# EAGLE design mainboardv0.2 (EAGLE 6.5.0)
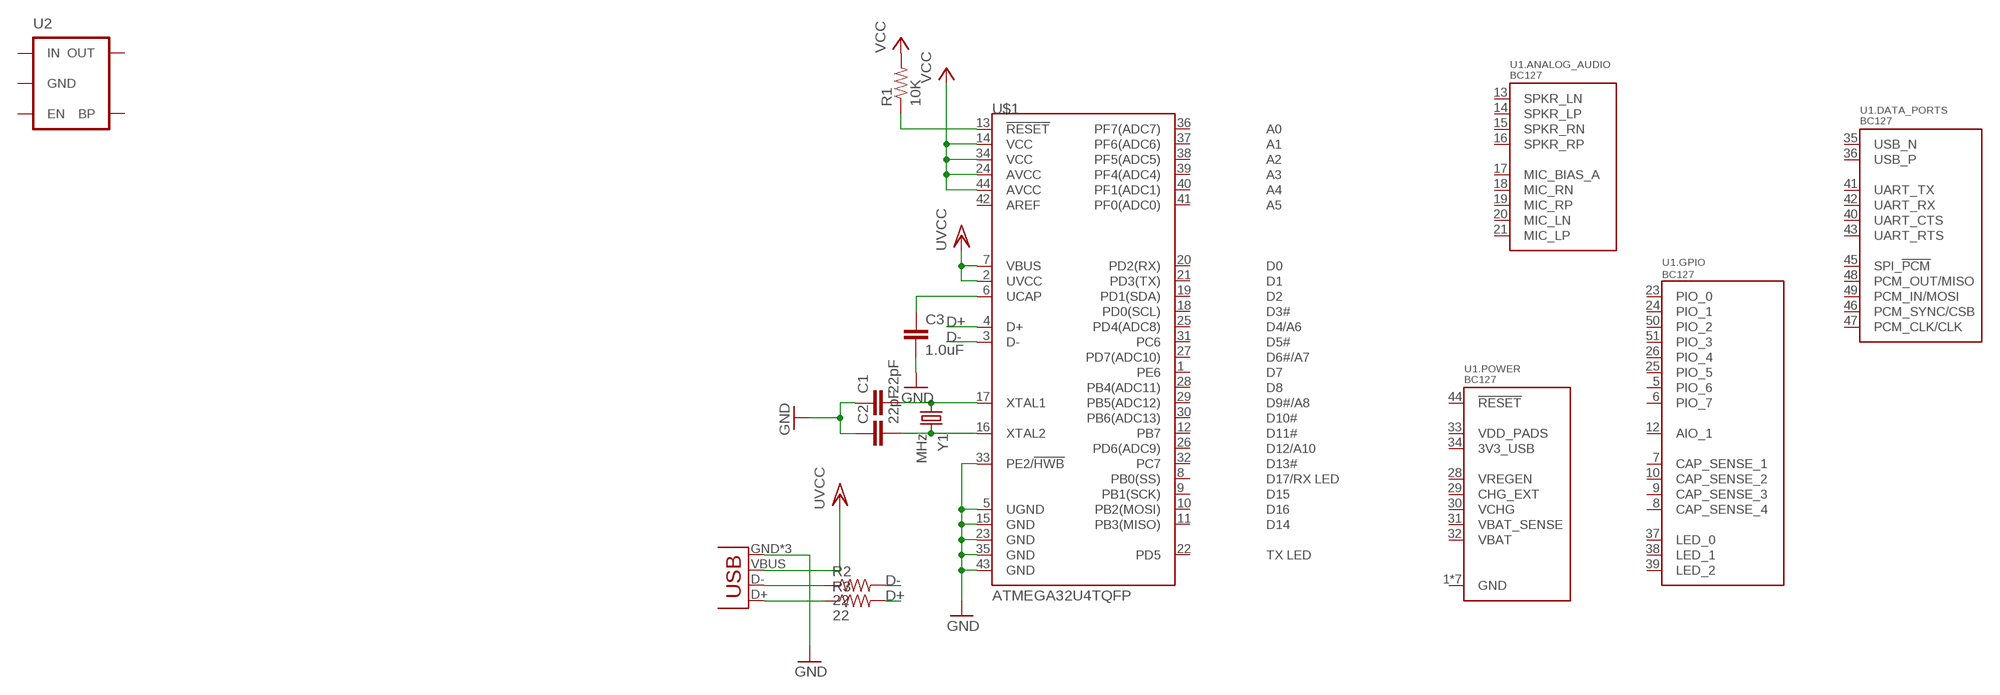
[diagram p0: schematic, sheet 1]

## Parts
C1  22pF  22PF-50V-5%(0603)  [0603-CAP]
C2  22pF  22PF-50V-5%(0603)  [0603-CAP]
C3  1.0uF  1.0UF-16V-10%(0603)  [0603-CAP]
JP1  USB-MICROB  [USB-MICROB]
R1  10K  10KOHM1/10W1%(0603)0603  [0603-RES]
R2  22  22OHM1/10W1%(0603)  [0603-RES]
R3  22  22OHM1/10W1%(0603)  [0603-RES]
U1  BC127  [BC127]
U2  MIC52053.3V  [SOT23-5]
U$1  ATMEGA32U4TQFP  [SPARKFUN-DIGITALIC_TQFP44]
Y1  MHz  CRYSTAL5X3  [CRYSTAL-SMD-5X3]

## Nets
D+: R3.2 U$1.4(D+)
D-: R2.2 U$1.3(D-)
GND: C1.1 C2.1 C3.2 JP1.GND JP1.MT1(GND) JP1.MT2(GND) U$1.5(UGND) U$1.15(GND) U$1.23(GND) U$1.33(PE2/!HWB) U$1.35(GND) U$1.43(GND)
N$1: R1.1 U$1.13(!RESET)
N$2: C1.2 U$1.17(XTAL1) Y1.1
N$3: C2.2 U$1.16(XTAL2) Y1.3
N$4: C3.1 U$1.6(UCAP)
N$7: JP1.D- R2.1
N$8: JP1.D+ R3.1
VCC: R1.2 U$1.14(VCC) U$1.24(AVCC) U$1.34(VCC) U$1.44(AVCC)
VCC/2: JP1.VBUS U$1.2(UVCC) U$1.7(VBUS) ; supply symbol labelled UVCC
Unconnected: U1.1(.POWER:GND) U1.2(.POWER:GND) U1.3(.POWER:GND) U1.4(.POWER:GND) U1.5(.GPIO:PIO_6) U1.6(.GPIO:PIO_7) U1.7(.GPIO:CAP_SENSE_1) U1.8(.GPIO:CAP_SENSE_4) U1.9(.GPIO:CAP_SENSE_3) U1.10(.GPIO:CAP_SENSE_2) U1.11(.POWER:GND) U1.12(.GPIO:AIO_1) U1.13(.ANALOG_AUDIO:SPKR_LN) U1.14(.ANALOG_AUDIO:SPKR_LP) U1.15(.ANALOG_AUDIO:SPKR_RN) U1.16(.ANALOG_AUDIO:SPKR_RP) U1.17(.ANALOG_AUDIO:MIC_BIAS_A) U1.18(.ANALOG_AUDIO:MIC_RN) U1.19(.ANALOG_AUDIO:MIC_RP) U1.20(.ANALOG_AUDIO:MIC_LN) U1.21(.ANALOG_AUDIO:MIC_LP) U1.22(.POWER:GND) U1.23(.GPIO:PIO_0) U1.24(.GPIO:PIO_1) U1.25(.GPIO:PIO_5) U1.26(.GPIO:PIO_4) U1.27(.POWER:GND) U1.28(.POWER:VREGEN) U1.29(.POWER:CHG_EXT) U1.30(.POWER:VCHG) U1.31(.POWER:VBAT_SENSE) U1.32(.POWER:VBAT) U1.33(.POWER:VDD_PADS) U1.34(.POWER:3V3_USB) U1.35(.DATA_PORTS:USB_N) U1.36(.DATA_PORTS:USB_P) U1.37(.GPIO:LED_0) U1.38(.GPIO:LED_1) U1.39(.GPIO:LED_2) U1.40(.DATA_PORTS:UART_CTS) U1.41(.DATA_PORTS:UART_TX) U1.42(.DATA_PORTS:UART_RX) U1.43(.DATA_PORTS:UART_RTS) U1.44(.POWER:!RESET) U1.45(.DATA_PORTS:SPI_!PCM) U1.46(.DATA_PORTS:PCM_SYNC/CSB) U1.47(.DATA_PORTS:PCM_CLK/CLK) U1.48(.DATA_PORTS:PCM_OUT/MISO) U1.49(.DATA_PORTS:PCM_IN/MOSI) U1.50(.GPIO:PIO_2) U1.51(.GPIO:PIO_3) U2.1(IN) U2.2(GND) U2.3(EN) U2.4(BP) U2.5(OUT) U$1.1(PE6) U$1.8(PB0(SS)) U$1.9(PB1(SCK)) U$1.10(PB2(MOSI)) U$1.11(PB3(MISO)) U$1.12(PB7) U$1.18(PD0(SCL)) U$1.19(PD1(SDA)) U$1.20(PD2(RX)) U$1.21(PD3(TX)) U$1.22(PD5) U$1.25(PD4(ADC8)) U$1.26(PD6(ADC9)) U$1.27(PD7(ADC10)) U$1.28(PB4(ADC11)) U$1.29(PB5(ADC12)) U$1.30(PB6(ADC13)) U$1.31(PC6) U$1.32(PC7) U$1.36(PF7(ADC7)) U$1.37(PF6(ADC6)) U$1.38(PF5(ADC5)) U$1.39(PF4(ADC4)) U$1.40(PF1(ADC1)) U$1.41(PF0(ADC0)) U$1.42(AREF)

## Library data of the parts
C1 C2 = SparkFun-Capacitors:22PF-50V-5%(0603): CAP-07876; PROD_ID: CAP-07876
C3 = SparkFun-Capacitors:1.0UF-16V-10%(0603): CAP-00868; PROD_ID: CAP-00868
JP1 = SparkFun-Connectors:USB: USB Connectors USB-B-PTH is fully proven SKU : PRT-00139/CONN-08278 USB-miniB is fully proven SKU : PRT-00587 USB-A-PCB is untested. USB-A-H is throughly reviewed, but untested. Spark Fun Electronics SKU : PRT-00437 USB-B-SMT is throughly reviewed, but untested. Needs silkscreen touching up. USB-A-S has not been used/tested USB-MB-H has not been used/tested USB-MICROB has been used. CONN-09505; PROD_ID: CONN-09505
R1 = SparkFun-Resistors:10KOHM1/10W1%(0603): RES-00824; PROD_ID: RES-00824
R2 R3 = SparkFun-Resistors:22OHM1/10W1%(0603): RES-08698; PROD_ID: RES-08698
U1 = SparkFun-RF:BC127: Blue Creations BC127 BLE module Hyper-competent Bluetooth 4.0 module, with: - Pre-4.0 support - 4 Cap sense inputs - 1 Analog input - 8 GPIO - 3 Open-drain LED drivers - Onboard battery charge circuitry - SPP/UART support - PCM Audio support - SPI port - Built-in USB - All kinds of other crazy crap
U2 = SparkFun-PowerIC:MIC5205: MIC5205 150mA vreg 3.3V - VREG-00822 5V - VREG-00823; PROD_ID: VREG-00822
U$1 = SparkFun-DigitalIC:ATMEGA32U4: Atmel 44-pin 8-bit Microcontroller with 32KBytes of ISP Flash and USB Controller ----- Please use the QFN-44-NOPAD_1:1 package for the footprint of all boards using a 32U4. Route traces directly away from the pads as much as possible.; PROD_ID: IC-11161
Y1 = SparkFun-FreqCtrl:CRYSTAL: Various standard crystals. Proven footprints. Spark Fun Electronics SKU : COM-00534

## Board
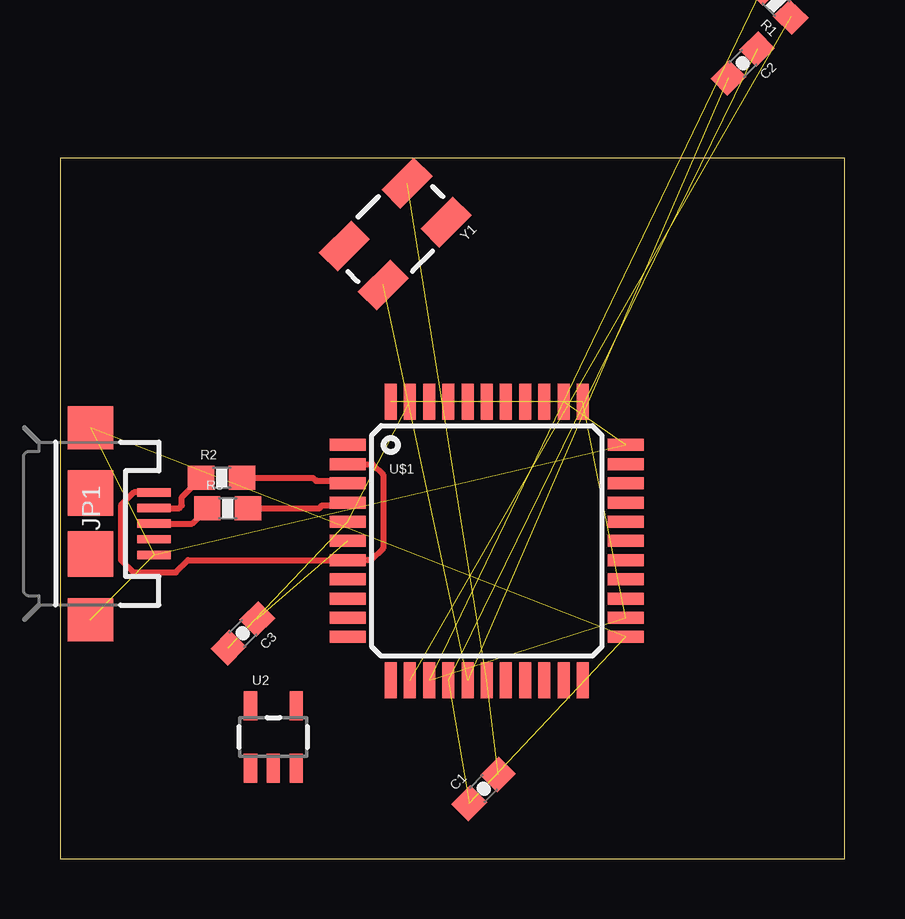
[diagram p1: board, top side]
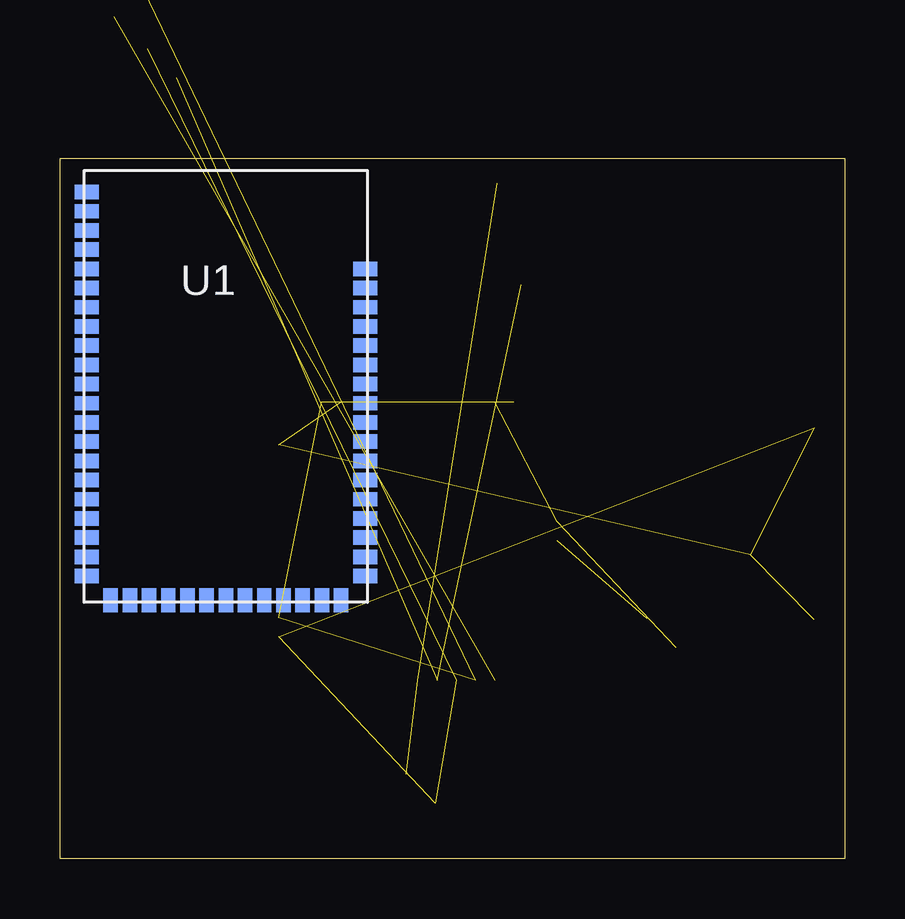
[diagram p2: board, bottom side, seen from below]

Size 32.69 x 29.2 mm. Coordinates in mm from the lower left corner, seen from the top.
Outline: 0,0 32.69,0 32.69,29.2 0,29.2 0,0
Copper layers (1*16): Top 0.0356mm / dielectric 1.5011mm / Bottom 0.0356mm
Design rules "LaenPCBOrder": minimum track width 6mil, minimum drill 13mil, track to track 6mil, track to pad 6mil, pad to pad 6mil, via to via 6mil, smd to smd 6mil, copper to edge 15mil, drill to drill 6mil, minimum pad ring 7mil, minimum via ring 7mil, stop-mask expansion 3mil, vias tented up to drill 0mil, thermal gap 10mil

### Footprints (pad centres in the part's own frame; a part is rotated, then mirrored left to right if it is on the bottom)
0603-CAP = smd 1.1 x 1: 1 -0.85,0; 2 0.85,0
USB-MICROB = smd 0.35 x 1.4: D+ 0,2.65; D- -0.65,2.65; GND 1.3,2.65; ID 0.65,2.65; VBUS -1.3,2.65 | smd 1.8 x 1.9: MT1 -4,0; MT2 4,0 | smd 1.9 x 1.9: P$1 -1.27,0; P$2 1.27,0
0603-RES = smd 1.1 x 1: 1 -0.85,0; 2 0.85,0
BC127 = smd 1 x 0.6: 1 -5.8,8.1; 2 -5.8,7.3; 3 -5.8,6.5; 4 -5.8,5.7; 5 -5.8,4.9; 6 -5.8,4.1; 7 -5.8,3.3; 8 -5.8,2.5; 9 -5.8,1.7; 10 -5.8,0.9; 11 -5.8,0.1; 12 -5.8,-0.7; 13 -5.8,-1.5; 14 -5.8,-2.3; 15 -5.8,-3.1; 16 -5.8,-3.9; 17 -5.8,-4.7; 18 -5.8,-5.5; 19 -5.8,-6.3; 20 -5.8,-7.1; 21 -5.8,-7.9; 35 5.8,-7.9; 36 5.8,-7.1; 37 5.8,-6.3; 38 5.8,-5.5; 39 5.8,-4.7; 40 5.8,-3.9; 41 5.8,-3.1; 42 5.8,-2.3; 43 5.8,-1.5; 44 5.8,-0.7; 45 5.8,0.1; 46 5.8,0.9; 47 5.8,1.7; 48 5.8,2.5; 49 5.8,3.3; 50 5.8,4.1; 51 5.8,4.9 | smd 0.6 x 1: 22 -4.8,-8.9; 23 -4,-8.9; 24 -3.2,-8.9; 25 -2.4,-8.9; 26 -1.6,-8.9; 27 -0.8,-8.9; 28 0,-8.9; 29 0.8,-8.9; 30 1.6,-8.9; 31 2.4,-8.9; 32 3.2,-8.9; 33 4,-8.9; 34 4.8,-8.9
SOT23-5 = smd 0.55 x 1.2: 1 -0.95,-1.3; 2 0,-1.3; 3 0.95,-1.3; 4 0.95,1.3; 5 -0.95,1.3
SPARKFUN-DIGITALIC_TQFP44 = smd 1.5 x 0.5: 1 -5.8,4; 2 -5.8,3.2; 3 -5.8,2.4; 4 -5.8,1.6; 5 -5.8,0.8; 6 -5.8,0; 7 -5.8,-0.8; 8 -5.8,-1.6; 9 -5.8,-2.4; 10 -5.8,-3.2; 11 -5.8,-4; 23 5.8,-4; 24 5.8,-3.2; 25 5.8,-2.4; 26 5.8,-1.6; 27 5.8,-0.8; 28 5.8,0; 29 5.8,0.8; 30 5.8,1.6; 31 5.8,2.4; 32 5.8,3.2; 33 5.8,4 | smd 0.5 x 1.5: 12 -4,-5.8; 13 -3.2,-5.8; 14 -2.4,-5.8; 15 -1.6,-5.8; 16 -0.8,-5.8; 17 0,-5.8; 18 0.8,-5.8; 19 1.6,-5.8; 20 2.4,-5.8; 21 3.2,-5.8; 22 4,-5.8; 34 4,5.8; 35 3.2,5.8; 36 2.4,5.8; 37 1.6,5.8; 38 0.8,5.8; 39 0,5.8; 40 -0.8,5.8; 41 -1.6,5.8; 42 -2.4,5.8; 43 -3.2,5.8; 44 -4,5.8
CRYSTAL-SMD-5X3 = smd 1.9 x 1.1: 1 -1.85,-1.15; 2 1.85,-1.15; 3 1.85,1.15; 4 -1.85,1.15

### Placement (x,y rotation side)
C1  17.65,2.92 45 top
C2  28.45,33.15 225 top  (outside the outline)
C3  7.62,9.4 225 top
JP1  1.27,13.97 270 top
R1  29.84,35.69 135 top  (outside the outline)
R2  6.73,15.88 0 top
R3  6.99,14.61 0 top
U1  25.78,19.68 0 bottom
U2  8.89,5.08 0 top
U$1  17.78,13.25 0 top
Y1  13.97,26.04 225 top

### Tracks (layer width: path | path; a pad name or v marks a point on that pad's centre or on a via)
D+
  Top 0.254: R3.2 10.79,14.61 10.92,14.73 11.86,14.73 U$1.4
D-
  Top 0.254: R2.2 10.54,15.88 10.67,15.75 11.88,15.75 U$1.3
GND  (11 unrouted)
N$1  (1 unrouted)
N$2  (2 unrouted)
N$3  (2 unrouted)
N$4  (1 unrouted)
N$7
  Top 0.254: JP1.D- 4.97,14.62 5.08,14.73 5.08,15.07 R2.1
N$8
  Top 0.254: JP1.D+ 5.5,13.97 R3.1
VCC  (4 unrouted)
VCC/2
  Top 0.254: JP1.VBUS 3.08,15.27 2.54,14.73 2.54,12.45 3.05,11.94 4.83,11.94 5.33,12.45 U$1.7 12.95,12.45 13.46,12.95 13.46,16 13.01,16.45 U$1.2